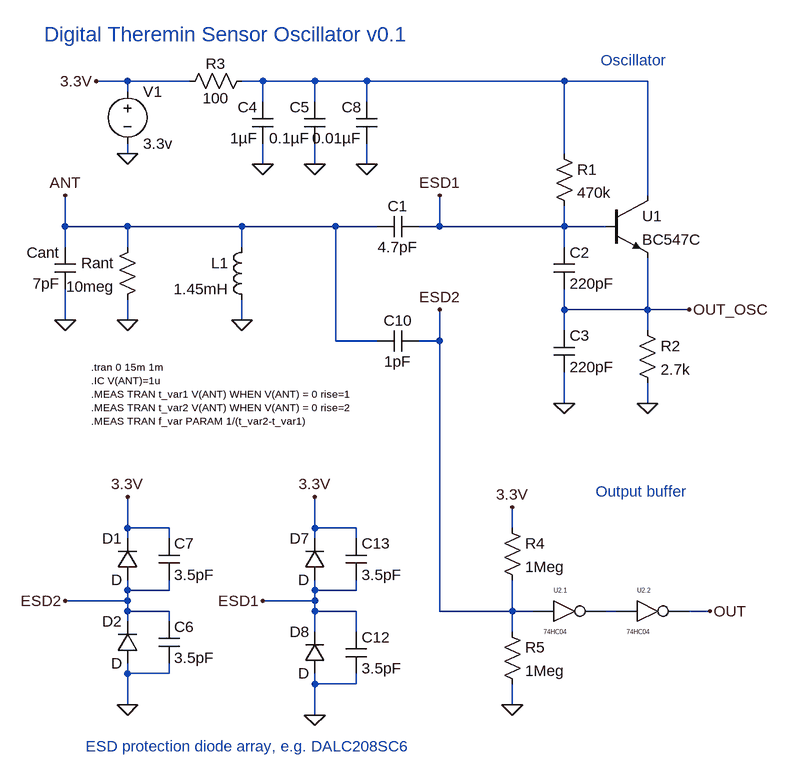
[diagram p0: schematic 2018_09_colpitts_npn_oscillator_v3.asc]
2018_09_colpitts_npn_oscillator_v3.asc, the LTspice schematic file:
Version 4
SHEET 1 2908 1268
WIRE -352 -32 -400 -32
WIRE -256 -32 -352 -32
WIRE -144 -32 -176 -32
WIRE -64 -32 -144 -32
WIRE 16 -32 -64 -32
WIRE 320 -32 16 -32
WIRE 448 -32 320 -32
WIRE -352 -16 -352 -32
WIRE -144 0 -144 -32
WIRE -64 0 -64 -32
WIRE 16 0 16 -32
WIRE -352 80 -352 64
WIRE 320 80 320 -32
WIRE -144 96 -144 64
WIRE -64 96 -64 64
WIRE 16 96 16 64
WIRE 448 144 448 -32
WIRE -448 192 -448 144
WIRE -352 192 -448 192
WIRE -176 192 -352 192
WIRE -32 192 -176 192
WIRE 32 192 -32 192
WIRE 128 192 128 144
WIRE 128 192 96 192
WIRE 320 192 320 160
WIRE 320 192 128 192
WIRE 384 192 320 192
WIRE -448 224 -448 192
WIRE -352 224 -352 192
WIRE -176 224 -176 192
WIRE 320 224 320 192
WIRE 320 320 320 288
WIRE 448 320 448 240
WIRE 448 320 320 320
WIRE 512 320 448 320
WIRE -448 336 -448 288
WIRE -352 336 -352 304
WIRE -176 336 -176 304
WIRE 320 352 320 320
WIRE 448 352 448 320
WIRE -32 368 -32 192
WIRE 32 368 -32 368
WIRE 128 368 128 320
WIRE 128 368 96 368
WIRE 320 464 320 416
WIRE 448 464 448 432
WIRE -352 656 -352 608
WIRE -288 656 -352 656
WIRE -64 656 -64 608
WIRE 0 656 -64 656
WIRE 240 656 240 624
WIRE -352 672 -352 656
WIRE -288 672 -288 656
WIRE -64 672 -64 656
WIRE 0 672 0 656
WIRE -352 752 -352 736
WIRE -288 752 -288 736
WIRE -288 752 -352 752
WIRE -64 752 -64 736
WIRE 0 752 0 736
WIRE 0 752 -64 752
WIRE -352 768 -352 752
WIRE -352 768 -448 768
WIRE -64 768 -64 752
WIRE -64 768 -144 768
WIRE -352 784 -352 768
WIRE -288 784 -352 784
WIRE -64 784 -64 768
WIRE 0 784 -64 784
WIRE 128 784 128 368
WIRE 240 784 240 736
WIRE 240 784 128 784
WIRE 272 784 240 784
WIRE 400 784 384 784
WIRE 544 784 512 784
WIRE -352 800 -352 784
WIRE -288 800 -288 784
WIRE -64 816 -64 784
WIRE 0 816 0 784
WIRE 240 816 240 784
WIRE -352 880 -352 864
WIRE -288 880 -288 864
WIRE -288 880 -352 880
WIRE -64 896 -64 880
WIRE 0 896 0 880
WIRE 0 896 -64 896
WIRE -352 928 -352 880
WIRE 240 928 240 896
WIRE -64 944 -64 896
FLAG -352 80 0
FLAG -400 -32 3.3V
FLAG -448 336 0
FLAG -448 144 ANT
FLAG -176 336 0
FLAG 320 464 0
FLAG 448 464 0
FLAG -352 336 0
FLAG 512 320 OUT_OSC
FLAG 544 784 OUT
FLAG 240 928 0
FLAG -64 944 0
FLAG -64 608 3.3V
FLAG -144 768 ESD1
FLAG -352 928 0
FLAG -352 608 3.3V
FLAG -448 768 ESD2
FLAG 240 624 3.3V
FLAG -144 96 0
FLAG -64 96 0
FLAG 16 96 0
FLAG 128 144 ESD1
FLAG 128 320 ESD2
SYMBOL cap 304 224 R0
SYMATTR InstName C2
SYMATTR Value 220pF
SYMBOL res 304 64 R0
SYMATTR InstName R1
SYMATTR Value 470k
SYMBOL voltage -352 -32 R0
WINDOW 123 0 0 Left 2
WINDOW 39 0 0 Left 2
SYMATTR InstName V1
SYMATTR Value 3.3v
SYMBOL ind -160 208 M0
SYMATTR InstName L1
SYMATTR Value 1.45mH
SYMATTR SpiceLine Ipk=0.1 Rser=65 Rpar=20Meg Cpar=0.85pF
SYMBOL cap -432 224 M0
SYMATTR InstName Cant
SYMATTR Value 7pF
SYMBOL cap 32 176 M90
WINDOW 0 0 32 VBottom 2
WINDOW 3 32 32 VTop 2
SYMATTR InstName C1
SYMATTR Value 4.7pF
SYMBOL npn 384 144 R0
SYMATTR InstName U1
SYMATTR Value BC547C
SYMBOL cap 304 352 R0
SYMATTR InstName C3
SYMATTR Value 220pF
SYMBOL res 432 336 R0
SYMATTR InstName R2
SYMATTR Value 2.7k
SYMBOL res -336 208 M0
SYMATTR InstName Rant
SYMATTR Value 10meg
SYMBOL cap -128 64 R180
WINDOW 0 24 56 Left 2
WINDOW 3 24 8 Left 2
SYMATTR InstName C4
SYMATTR Value 1µF
SYMBOL EXTRA\\74HC\\74hc04 320 720 R0
SYMATTR InstName U2.1
SYMATTR SpiceLine VCC=3.3  SPEED=1.0  TRIPDT=1e-9
SYMBOL EXTRA\\74HC\\74hc04 448 720 R0
SYMATTR InstName U2.2
SYMATTR SpiceLine VCC=3.3  SPEED=1.0  TRIPDT=1e-9
SYMBOL res -272 -16 R270
WINDOW 0 27 56 VTop 2
WINDOW 3 5 56 VBottom 2
SYMATTR InstName R3
SYMATTR Value 100
SYMBOL res 224 640 R0
SYMATTR InstName R4
SYMATTR Value 1Meg
SYMBOL res 224 800 R0
SYMATTR InstName R5
SYMATTR Value 1Meg
SYMBOL cap 32 352 M90
WINDOW 0 0 32 VBottom 2
WINDOW 3 32 32 VTop 2
SYMATTR InstName C10
SYMATTR Value 1pF
SYMBOL diode -48 736 R180
WINDOW 0 24 64 Left 2
WINDOW 3 24 0 Left 2
SYMATTR InstName D7
SYMBOL diode -48 880 R180
WINDOW 0 24 64 Left 2
WINDOW 3 24 0 Left 2
SYMATTR InstName D8
SYMBOL cap -16 816 R0
SYMATTR InstName C12
SYMATTR Value 3.5pF
SYMBOL cap -16 672 R0
SYMATTR InstName C13
SYMATTR Value 3.5pF
SYMBOL diode -336 736 R180
WINDOW 0 24 64 Left 2
WINDOW 3 24 0 Left 2
SYMATTR InstName D1
SYMBOL diode -336 864 R180
WINDOW 0 24 64 Left 2
WINDOW 3 24 0 Left 2
SYMATTR InstName D2
SYMBOL cap -304 800 R0
SYMATTR InstName C6
SYMATTR Value 3.5pF
SYMBOL cap -304 672 R0
SYMATTR InstName C7
SYMATTR Value 3.5pF
SYMBOL cap -48 64 R180
WINDOW 0 24 56 Left 2
WINDOW 3 24 8 Left 2
SYMATTR InstName C5
SYMATTR Value 0.1µF
SYMBOL cap 32 64 R180
WINDOW 0 24 56 Left 2
WINDOW 3 24 8 Left 2
SYMATTR InstName C8
SYMATTR Value 0.01µF
TEXT -408 408 Left 1 !.tran 0 15m 1m\n.IC V(ANT)=1u\n.MEAS TRAN t_var1 V(ANT) WHEN V(ANT) = 0 rise=1\n.MEAS TRAN t_var2 V(ANT) WHEN V(ANT) = 0 rise=2\n.MEAS TRAN f_var PARAM 1/(t_var2-t_var1)
TEXT -480 -104 Left 3 ;Digital Theremin Sensor Oscillator v0.1
TEXT -416 992 Left 2 ;ESD protection diode array, e.g. DALC208SC6
TEXT 376 -64 Left 2 ;Oscillator
TEXT 368 600 Left 2 ;Output buffer

The netlist it stands for:
* 2018_09_colpitts_npn_oscillator_v3.asc
C2 ESD1 OUT_OSC 220pF
R1 N001 ESD1 470k
V1 3.3V 0 3.3v
L1 ANT 0 1.45mH Ipk=0.1 Rser=65 Rpar=20Meg Cpar=0.85pF
Cant ANT 0 7pF
C1 ANT ESD1 4.7pF
Q§U1 N001 ESD1 OUT_OSC 0 BC547C
C3 OUT_OSC 0 220pF
R2 OUT_OSC 0 2.7k
Rant ANT 0 10meg
C4 0 N001 1µF
XU2.1 ESD2 N002 VCC 0 74HC04 VCC=3.3  SPEED=1.0  TRIPDT=1e-9  ; pins A Y
XU2.2 N002 OUT VCC 0 74HC04 VCC=3.3  SPEED=1.0  TRIPDT=1e-9  ; pins A Y
R3 3.3V N001 100
R4 3.3V ESD2 1Meg
R5 ESD2 0 1Meg
C10 ANT ESD2 1pF
D7 ESD1 3.3V D
D8 0 ESD1 D
C12 ESD1 0 3.5pF
C13 3.3V ESD1 3.5pF
D1 ESD2 3.3V D
D2 0 ESD2 D
C6 ESD2 0 3.5pF
C7 3.3V ESD2 3.5pF
C5 0 N001 0.1µF
C8 0 N001 0.01µF
.model D D
.lib standard.dio
.model NPN NPN
.model PNP PNP
.lib standard.bjt
.tran 0 15m 1m
.IC V(ANT)=1u
.MEAS TRAN t_var1 V(ANT) WHEN V(ANT) = 0 rise=1
.MEAS TRAN t_var2 V(ANT) WHEN V(ANT) = 0 rise=2
.MEAS TRAN f_var PARAM 1/(t_var2-t_var1)
* Digital Theremin Sensor Oscillator v0.1
* ESD protection diode array, e.g. DALC208SC6
* Oscillator
* Output buffer
.lib 74HC.lib
.backanno
.end